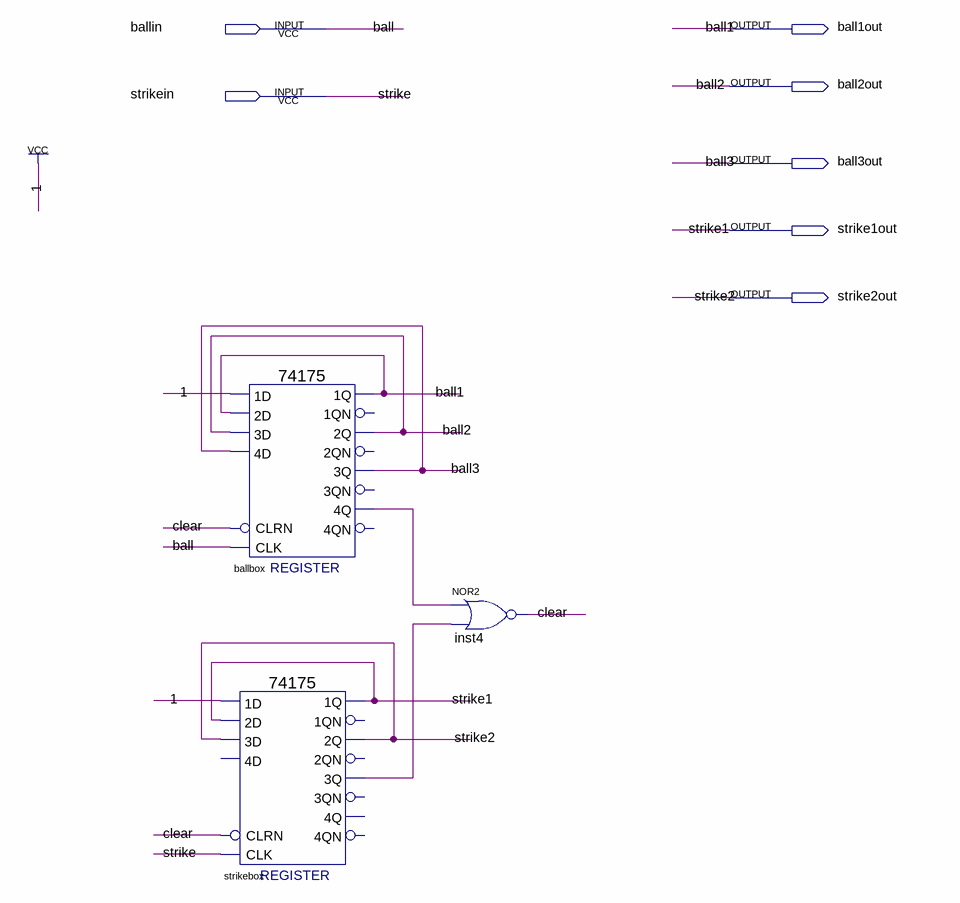
[diagram p0: schematic sheet]
// Quartus schematic Final5.bdf as structural Verilog: 3 symbols, 7 pins
module Final5 (
  input  ballin,
  input  strikein,
  output ball1out,
  output ball2out,
  output ball3out,
  output strike1out,
  output strike2out
);

  wire ballbox_4q, clear, strikebox_3q;

  \74175  ballbox (
    .CLRN(clear), .CLK(ballin), .\3D (ball2out), .\2D (ball1out), .\1D (1'b1), .\4D (ball3out),
    .\1Q (ball1out), .\3Q (ball3out), .\2Q (ball2out), .\4Q (ballbox_4q));  // open: 1QN, 2QN, 4QN, 3QN
  \74175  strikebox (
    .CLRN(clear), .CLK(strikein), .\3D (strike2out), .\2D (strike1out), .\1D (1'b1), .\1Q (strike1out),
    .\3Q (strikebox_3q), .\2Q (strike2out));  // open: 4D, 1QN, 2QN, 4QN, 4Q, 3QN
  nor inst4 (clear, ballbox_4q, strikebox_3q);

  // Other names for the same wires on the sheet: ball = ballin; ball1 = ball1out; ball2 = ball2out; ball3 = ball3out;
  //   strike = strikein; strike1 = strike1out; strike2 = strike2out
endmodule
